# EasyEDA schematic schematic.json
TITLE: Sheet_1; REV: 1.0; Date: 2024-06-29; Sheet: 1/1; Drawn By: matthewcollegesacc; Company: Your Company
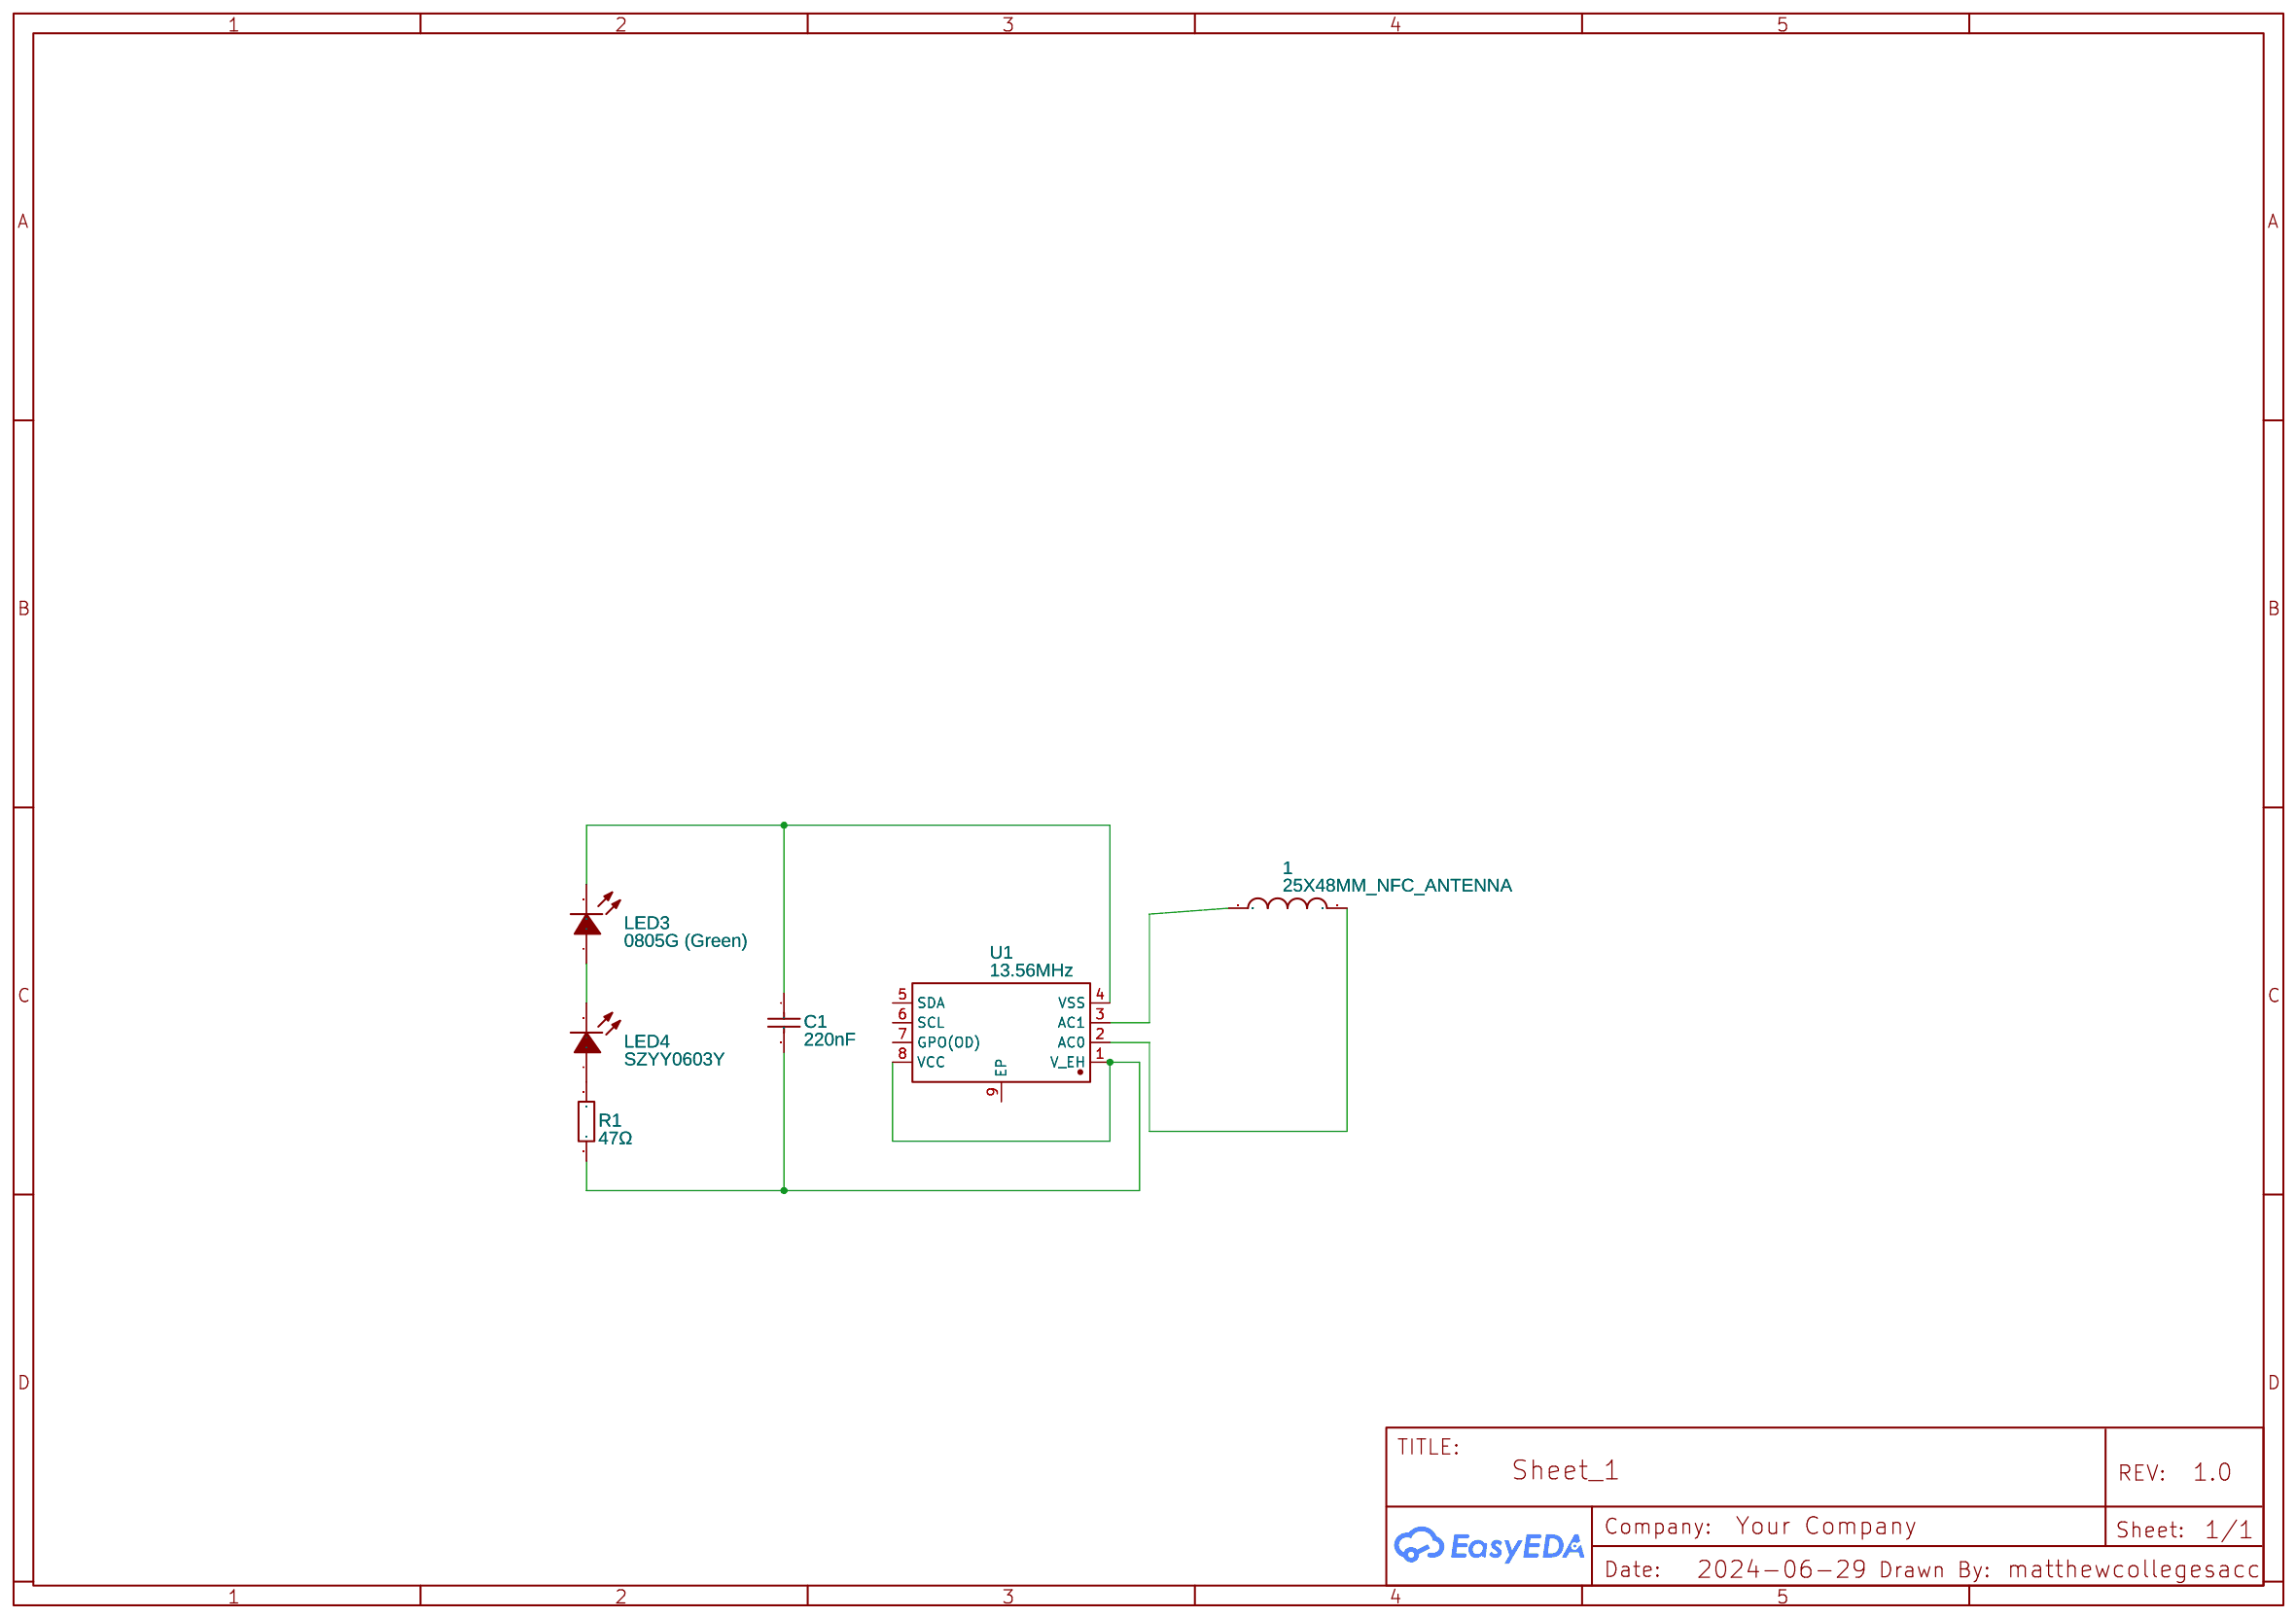
[diagram p0: schematic sheet]

## Parts
1  25X48MM_NFC_ANTENNA  [25X48MM_NFC_ANTENNA]
C1  220nF  [C0603]
LED3  0805G (Green)  [LED0805-R-RD]
LED4  SZYY0603Y  [LED0603-R-RD-YELLOW]
R1  47Ω  [R0603]
U1  13.56MHz  [UFDFN-8_L3.0-W2.0-P0.50-TL-EP1.4]

## Library data of the parts
1 = 25X48MM_NFC_ANTENNA: Contributor: dnonoo
C1 = CL10B224KA8NNNC: Supplier: LCSC; Manufacturer: SAMSUNG(三星); Supplier Part: C21120; JLCPCB Part Class: Basic Part
LED3 = 0805G (Green): Supplier: LCSC; Manufacturer: KENTO; Manufacturer Part: KT-0805G; Supplier Part: C2297; JLCPCB Part Class: Basic Part
LED4 = SZYY0603Y: Contributor: LCSC; Supplier: LCSC; Supplier Part: C434424; Manufacturer: yongyu(永裕光电); JLCPCB Part Class: Extended Part
R1 = 0603WAF470JT5E: Supplier: LCSC; Manufacturer: UNI-ROYAL(厚声); Supplier Part: C23182; JLCPCB Part Class: Basic Part
U1 = ST25DV04K-IER6C3: Contributor: LCSC; Supplier: LCSC; Supplier Part: C2908287; Manufacturer: ST(意法半导体); JLCPCB Part Class: Extended Part

## Nets
Net-(1-P$1): 1.P$1 U1.3(AC1)
Net-(1-P$2): 1.P$2 U1.2(AC0)
Net-(C1-1): C1.1 LED3.2(K) U1.4(VSS)
Net-(C1-2): C1.2 R1.2 U1.1(V_EH) U1.8(VCC)
Net-(LED3-1): LED3.1(A) LED4.2(-)
Net-(LED4-1): LED4.1(+) R1.1

Not connected (* = marked no-connect by the designer): U1 5(SDA) 6(SCL) 7(GPO(OD)) 9(EP)
